# Altium schematic sheet Microcontroller.SchDoc
size A3; SheetNumber: 2; SheetTotal: 5
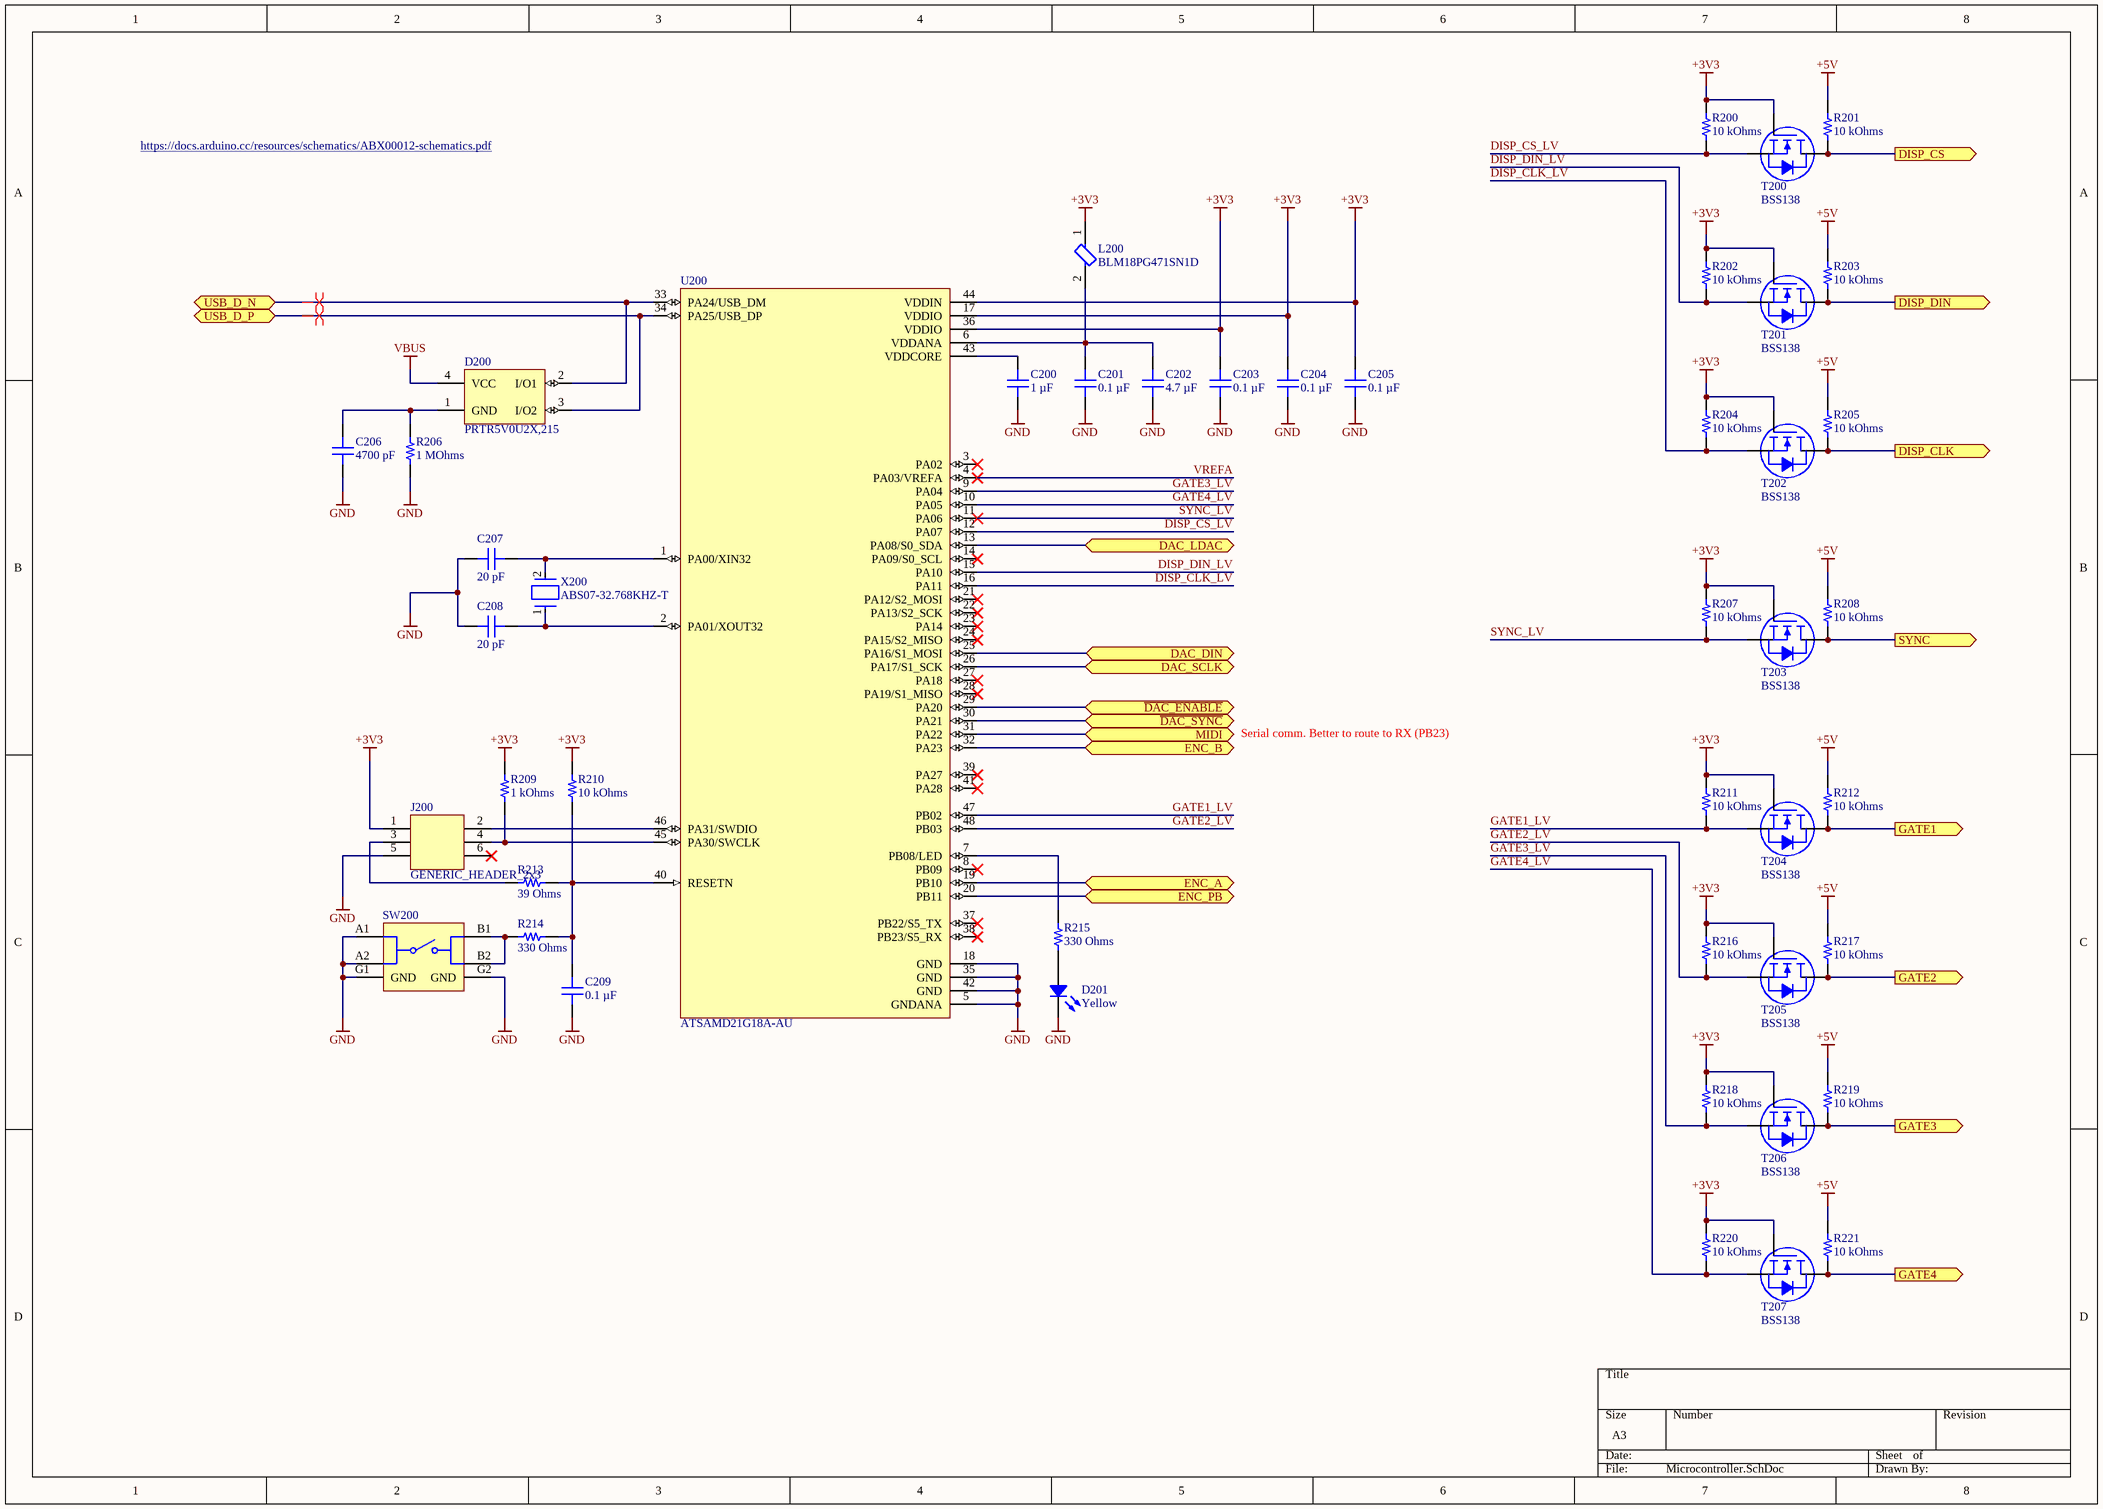
[diagram p0: Microcontroller.SchDoc]

## Parts
C200  1 µF  [CAP 0603_1608]
C201  0.1 µF  [CAP 0603_1608]
C202  4.7 µF  [CAP 0603_1608]
C203  0.1 µF  [CAP 0603_1608]
C204  0.1 µF  [CAP 0603_1608]
C205  0.1 µF  [CAP 0603_1608]
C206  4700 pF  [CAP 0603_1608]
C207  20 pF  [CAP 0603_1608]
C208  20 pF  [CAP 0603_1608]
C209  0.1 µF  [CAP 0603_1608]
D200  PRTR5V0U2X,215  [NXP-SOT143B-4_V]
D201  Yellow  [LED 0603_1608 YELLOW]
J200  GENERIC_HEADER_2x3  [HEADER_2x3_TH_MALE]
L200  BLM18PG471SN1D  [FP-BLM18-0_15-t0_8-MFG]
R200  10 kOhms  [RES 0603_1608]
R201  10 kOhms  [RES 0603_1608]
R202  10 kOhms  [RES 0603_1608]
R203  10 kOhms  [RES 0603_1608]
R204  10 kOhms  [RES 0603_1608]
R205  10 kOhms  [RES 0603_1608]
R206  1 MOhms  [RES 0603_1608]
R207  10 kOhms  [RES 0603_1608]
R208  10 kOhms  [RES 0603_1608]
R209  1 kOhms  [RES 0603_1608]
R210  10 kOhms  [RES 0603_1608]
R211  10 kOhms  [RES 0603_1608]
R212  10 kOhms  [RES 0603_1608]
R213  39 Ohms  [RES 0603_1608]
R214  330 Ohms  [RES 0603_1608]
R215  330 Ohms  [RES 0603_1608]
R216  10 kOhms  [RES 0603_1608]
R217  10 kOhms  [RES 0603_1608]
R218  10 kOhms  [RES 0603_1608]
R219  10 kOhms  [RES 0603_1608]
R220  10 kOhms  [RES 0603_1608]
R221  10 kOhms  [RES 0603_1608]
SW200  435171014816  [435171014816]  (value not drawn)
T200  BSS138  [ON SEMI SOT-23-3]
T201  BSS138  [ON SEMI SOT-23-3]
T202  BSS138  [ON SEMI SOT-23-3]
T203  BSS138  [ON SEMI SOT-23-3]
T204  BSS138  [ON SEMI SOT-23-3]
T205  BSS138  [ON SEMI SOT-23-3]
T206  BSS138  [ON SEMI SOT-23-3]
T207  BSS138  [ON SEMI SOT-23-3]
U200  ATSAMD21G18A-AU  [ATML-TQFP48]
X200  ABS07-32.768KHZ-T  [FP-ABS07-MFG]

## Ports
DAC_DIN (bidir), DAC_LDAC (bidir), DAC_SCLK (bidir), DISP_CLK (out), DISP_CS (out), DISP_DIN (out), ENC_A (bidir), ENC_B (bidir), ENC_PB (bidir), GATE1 (out), GATE2 (out), GATE3 (out), GATE4 (out), MIDI (bidir), SYNC (out), USB_D_N (bidir), USB_D_P (bidir), ~{DAC_ENABLE} (bidir), ~{DAC_SYNC} (bidir)

## Nets
+3V3: C203.2 C204.2 C205.2 J200.1 L200.1 R200.2 R202.2 R204.2 R207.2 R209.2 R210.2 R211.2 R216.2 R218.2 R220.2 T200.1(G) T201.1(G) T202.1(G) T203.1(G) T204.1(G) T205.1(G) T206.1(G) T207.1(G) U200.17(VDDIO) U200.36(VDDIO) U200.44(VDDIN)
+5V: R201.2 R203.2 R205.2 R208.2 R212.2 R217.2 R219.2 R221.2
GND: C200.1 C201.1 C202.1 C203.1 C204.1 C205.1 C206.1 C207.1 C208.1 C209.1 D201.2 J200.5 R206.1 SW200.A1 SW200.A2 SW200.G1(GND) SW200.G2(GND) U200.5(GNDANA) U200.18(GND) U200.35(GND) U200.42(GND)
VBUS: D200.4(VCC)
~{DAC_ENABLE}: U200.29(PA20) ; port ~{DAC_ENABLE}
~{DAC_SYNC}: U200.30(PA21) ; port ~{DAC_SYNC}
DAC_DIN: U200.25(PA16/S1_MOSI) ; port DAC_DIN
DAC_LDAC: U200.13(PA08/S0_SDA) ; port DAC_LDAC
DAC_SCLK: U200.26(PA17/S1_SCK) ; port DAC_SCLK
DISP_CLK: R205.1 T202.3(D) ; port DISP_CLK
DISP_CLK_LV: R204.1 T202.2(S) U200.16(PA11)
DISP_CS: R201.1 T200.3(D) ; port DISP_CS
DISP_CS_LV: R200.1 T200.2(S) U200.12(PA07)
DISP_DIN: R203.1 T201.3(D) ; port DISP_DIN
DISP_DIN_LV: R202.1 T201.2(S) U200.15(PA10)
ENC_A: U200.19(PB10) ; port ENC_A
ENC_B: U200.32(PA23) ; port ENC_B
ENC_PB: U200.20(PB11) ; port ENC_PB
GATE1: R212.1 T204.3(D) ; port GATE1
GATE1_LV: R211.1 T204.2(S) U200.47(PB02)
GATE2: R217.1 T205.3(D) ; port GATE2
GATE2_LV: R216.1 T205.2(S) U200.48(PB03)
GATE3: R219.1 T206.3(D) ; port GATE3
GATE3_LV: R218.1 T206.2(S) U200.9(PA04)
GATE4: R221.1 T207.3(D) ; port GATE4
GATE4_LV: R220.1 T207.2(S) U200.10(PA05)
MIDI: U200.31(PA22) ; port MIDI
SYNC: R208.1 T203.3(D) ; port SYNC
SYNC_LV: R207.1 T203.2(S) U200.11(PA06)
USB_D_N: D200.2(I/O1) U200.33(PA24/USB_DM) ; port USB_D_N
USB_D_P: D200.3(I/O2) U200.34(PA25/USB_DP) ; port USB_D_P
VREFA: U200.4(PA03/VREFA)
NetC200_2: C200.2 U200.43(VDDCORE)
NetC201_2: C201.2 C202.2 L200.2 U200.6(VDDANA)
NetC206_2: C206.2 D200.1(GND) R206.2
NetC207_2: C207.2 U200.1(PA00/XIN32) X200.2
NetC208_2: C208.2 U200.2(PA01/XOUT32) X200.1
NetC209_2: C209.2 R210.1 R213.2 R214.2 U200.40(RESETN)
NetD201_1: D201.1 R215.2
NetJ200_2: J200.2 U200.46(PA31/SWDIO)
NetJ200_3: J200.3 R213.1
NetJ200_4: J200.4 R209.1 U200.45(PA30/SWCLK)
NetR214_1: R214.1 SW200.B1 SW200.B2
NetR215_1: R215.1 U200.7(PB08/LED)

Not connected (* = marked no-connect by the designer): J200 6*; U200 3(PA02)* 8(PB09)* 14(PA09/S0_SCL)* 21(PA12/S2_MOSI)* 22(PA13/S2_SCK)* 23(PA14)* 24(PA15/S2_MISO)* 27(PA18)* 28(PA19/S1_MISO)* 37(PB22/S5_TX)* 38(PB23/S5_RX)* 39(PA27)* 41(PA28)*

## Layout directives
differential pair: USB_D_N, USB_D_P

## Notes on the sheet
- https://docs.arduino.cc/resources/schematics/ABX00012-schematics.pdf
- Serial comm. Better to route to RX (PB23)

## Library data of the parts
C200 = CC0603KRX7R6BB105: CAP CER 1UF 10V X7R 0603; manufacturer: Yageo; Tolerance: ±10%; Part Number: CC0603KRX7R6BB105; Value: 1 µF; Applications: General Purpose; Capacitance: 1 µF; componentlink1description: Datasheet; componentlink1url: https://www.yageo.com/upload/media/product/productsearch/datasheet/mlcc/UPY-GPHC_X7R_6.3V-to-50V_18.pdf; componentlink2description: DigiKey Link; componentlink2url: https://www.digikey.com/en/products/detail/yageo/CC0603KRX7R6BB105/5195204; Device Package: 0603 (1608 Metric); lastupdated: 09/02/2024 20:10:30; Lifecycle Status: Active; Minimum Order: 1; Mounting Type: Surface Mount, MLCC; Operating Temperature: -55°C ~ 125°C; Package / Case: 0603 (1608 Metric); packaging: TapeAndReel; partid: 2290; Part Status: Active; price: 0.01; series: CC; Size / Dimension: 0.063" L x 0.031" W (1.60mm x 0.80mm); Supplier 1: DigiKey; Supplier Part Number 1: 311-1796-1-ND; Temperature Coefficient: X7R; Thickness (Max): 0.035" (0.90mm); Voltage - Rated: 10V
C201 C203-C205 C209 = CS0603KRX7R7BB104: CAP CER 0.1UF 16V X7R 0603; manufacturer: Yageo; Tolerance: ±10%; Part Number: CS0603KRX7R7BB104; Value: 0.1 µF; Applications: Boardflex Sensitive; Capacitance: 0.1 µF; componentlink1description: Datasheet; componentlink1url: http://www.yageo.com/NewPortal/yageodocoutput?fileName=/pdf/MLCC/UPY-ST_NPOX7R_16V-to-3KV_5.pdf; componentlink2description: DigiKey Link; componentlink2url: https://www.digikey.com/en/products/detail/yageo/CS0603KRX7R7BB104/6097897; Device Package: 0603 (1608 Metric); Features: Soft Termination; lastupdated: 09/02/2024 20:10:30; Lifecycle Status: Active; Minimum Order: 1; Mounting Type: Surface Mount, MLCC; Operating Temperature: -55°C ~ 125°C; Package / Case: 0603 (1608 Metric); packaging: TapeAndReel; partid: 2286; Part Status: Active; price: 0.01; series: CS; Size / Dimension: 0.063" L x 0.031" W (1.60mm x 0.80mm); Supplier 1: DigiKey; Supplier Part Number 1: 311-3560-1-ND; Temperature Coefficient: X7R; Thickness (Max): 0.037" (0.95mm); Voltage - Rated: 16V
C202 = CC0603MRX5R6BB475: CAP CER 4.7UF 10V X5R 0603; manufacturer: Yageo; Tolerance: ±20%; Part Number: CC0603MRX5R6BB475; Value: 4.7 µF; Applications: General Purpose; Capacitance: 4.7 µF; componentlink1description: Datasheet; componentlink1url: https://www.yageo.com/upload/media/product/productsearch/datasheet/mlcc/UPY-GPHC_X5R_4V-to-50V_25.pdf; componentlink2description: DigiKey Link; componentlink2url: https://www.digikey.com/en/products/detail/yageo/CC0603MRX5R6BB475/5195227; Device Package: 0603 (1608 Metric); lastupdated: 09/02/2024 20:10:21; Lifecycle Status: Active; Minimum Order: 1; Mounting Type: Surface Mount, MLCC; Operating Temperature: -55°C ~ 85°C; Package / Case: 0603 (1608 Metric); packaging: TapeAndReel; partid: 9357; Part Status: Active; price: 0.02; series: CC; Size / Dimension: 0.063" L x 0.031" W (1.60mm x 0.80mm); Supplier 1: DigiKey; Supplier Part Number 1: 311-1820-1-ND; Temperature Coefficient: X5R; Thickness (Max): 0.035" (0.90mm); Voltage - Rated: 10V
C206 = CC0603JRX7R9BB472: CAP CER 4700PF 50V X7R 0603; manufacturer: Yageo; Tolerance: ±5%; Part Number: CC0603JRX7R9BB472; Value: 4700 pF; Applications: General Purpose; Capacitance: 4700 pF; componentlink1description: Datasheet; componentlink1url: https://www.yageo.com/upload/media/product/productsearch/datasheet/mlcc/UPY-GPHC_X7R_6.3V-to-50V_18.pdf; componentlink2description: DigiKey Link; componentlink2url: https://www.digikey.com/en/products/detail/yageo/CC0603JRX7R9BB472/5883693; Device Package: 0603 (1608 Metric); lastupdated: 09/02/2024 20:10:27; Lifecycle Status: Active; Minimum Order: 1; Mounting Type: Surface Mount, MLCC; Operating Temperature: -55°C ~ 125°C; Package / Case: 0603 (1608 Metric); packaging: TapeAndReel; partid: 5065; Part Status: Active; price: 0.01; series: CC; Size / Dimension: 0.063" L x 0.031" W (1.60mm x 0.80mm); Supplier 1: DigiKey; Supplier Part Number 1: 311-3363-1-ND; Temperature Coefficient: X7R; Thickness (Max): 0.035" (0.90mm); Voltage - Rated: 50V
C207 C208 = CC0603JRNPO9BN200: CAP CER 20PF 50V C0G/NPO 0603; manufacturer: Yageo; Temperature Coefficient: C0G, NP0; Tolerance: ±5%; Part Number: CC0603JRNPO9BN200; Value: 20 pF; Applications: General Purpose; Capacitance: 20 pF; componentlink1description: Datasheet; componentlink1url: https://www.yageo.com/upload/media/product/productsearch/datasheet/mlcc/UPY-GP_NP0_16V-to-50V_17.pdf; componentlink2description: DigiKey Link; componentlink2url: https://www.digikey.com/en/products/detail/yageo/CC0603JRNPO9BN200/2833589; Device Package: 0603 (1608 Metric); lastupdated: 09/02/2024 20:10:09; Lifecycle Status: Active; Minimum Order: 1; Mounting Type: Surface Mount, MLCC; Operating Temperature: -55°C ~ 125°C; Package / Case: 0603 (1608 Metric); packaging: TapeAndReel; partid: 16728; Part Status: Active; price: 0.01; series: CC; Size / Dimension: 0.063" L x 0.031" W (1.60mm x 0.80mm); Supplier 1: DigiKey; Supplier Part Number 1: 311-1424-1-ND; Thickness (Max): 0.035" (0.90mm); Voltage - Rated: 50V
D200 = PRTR5V0U2X,215: Ultra Low Capacitance Double Rail-to-Rail ESD Protection Diode, 5.5 V, 1 pF, -40 to 85 degC, 4-Pin SOT143B, RoHS, Tape and Reel; Manufacturer: NXP Semiconductors; Capacitance Value: 16pF; Number of Elements: 1; Rad Hardened: No; Reverse Breakdown Voltage: 6V; Working Voltage (Max): 5.5V; Polarity: Uni-Directional; Configuration: Quad; Leakage Current: 0.1uA; Product Height (mm): 1mm; Suppressor Type: DiodeArrays; Product Length (mm): 3mm; Product Depth (mm): 1.4mm; ESD Protection Voltage: 8KV@ContactDisc; Package Type: SOT; Mounting: SurfaceMount; Packaging: TapeandReel; Datasheet Version: Rev. 02, 01/2008; Reverse Stand-off Voltage: 5.5V; Manufacturer URL: http://www.nxp.com/; Operating Temp Range: -40Cto85C; Operating Temperature Classification: Industrial; Working Voltage: 5.5V; Operating Temperature Min Deg. C: -40C; Datasheet URL: https://datasheet.ciiva.com/4479/prtr5v0u2x-102853-4479461.pdf; Leakage Current (Max): 0.1uA; Direction Type: Uni-Directional; Pin Count: 3+Tab; Operating Temperature Max Deg. C: 85C; Mounting Style: SurfaceMount; Package / Case: SOT
D201 = 5990040007F: LED YELLOW 0603 SMD; Manufacturer: Dialight; Configuration: Standard; Current - Test: 20mA; Lens Color: 0.80mm; Lens Size: 1.10mm x 0.80mm; Lens Style: Rectangle with Flat Top; Millicandela Rating: 105mcd; Viewing Angle: 140°; Voltage - Forward (Vf) (Typ): 2.1V; Wavelength - Dominant: 590nm; Part Number: 5990040007F; Color: Yellow; ComponentLink1Description: Datasheet; ComponentLink1URL: http://www.dialightsignalsandcomponents.com/Assets/Brochures_And_Catalogs/Indication/CBI_SMD_new/Dialight_CBI_data_599-0603_Apr2018.pdf; ComponentLink2Description: DigiKey Link; ComponentLink2URL: https://www.digikey.com/en/products/detail/dialight/5990040007F/9385404; Device Package: 0603 (1608 Metric); Height (Max): 0.80mm; LastUpdated: 03/06/2024 20:01:10; Lifecycle Status: Active; Minimum Order: 1; Mounting Type: Surface Mount; Package / Case: 0603 (1608 Metric); Packaging: TapeAndReel; PartId: 83; Part Status: Active; Price: 0.04; Series: 599; Size / Dimension: 1.60mm L x 0.80mm W; Supplier 1: DigiKey; Supplier Part Number 1: 350-4349-1-ND; Supplier Device Package: 0603; Value: Yellow
J200 = GENERIC_HEADER_2x3: NexarPartId: 32855449; Number of Positions: 6; Voltage Rating: 250V; Current Rating: 3A; Pitch: 2.54mm; Gender: Male; Contact Resistance: 20mΩ; Connector Type: Male Pin; Packaging: Tape and Reel; Contact Plating: Gold; RoHS: Compliant; Termination: Solder; Operating Supply Voltage: 250V; REACH SVHC: Unknown; Mount: Surface Mount; Number of Pins: 6; Contact Mating Length: 5.9944mm; Contact Material: Copper; Max Operating Temperature: 105°C; Orientation: Vertical; Number of Contacts: 6; Min Operating Temperature: -40°C; Number of Rows: 2; Lead Pitch: 2.54mm; Height: 10mm; Row Spacing: 2.54mm; Color: Black
L200 = CMP-0686-00587-3: Chip Ferrite Bead, 0603, 470Ω @ 100MHz, 0.2Ω, 25%, 1A; DC Resistance (DCR): 200mR; Number of Circuits: 1; Material: Steel; Impedance: 470R; Core Material: Ferrite; Width: 0.8mm; Termination: SMD/SMT; Series: BLM18P; Min Operating Temperature: -55°C; DC Resistance-Max: 200mR; Current Rating: 1A; Package Quantity: 1; Max Operating Temperature: 125°C; Military Standard: Not; REACH SVHC: No SVHC; Max Current Rating: 1A; Number of Pins: 2; RoHS Compliant: Yes; Tolerance: 25%; Packaging: Tape and Reel; Number of Lines: 1; Resistance: 200mR; Length: 1.6mm; Case Code (Metric): 1608; Depth: 0.8mm; Lead Free: Lead Free; Case/Package: 0603; Height: 0.8mm; Radiation Hardening: No; Test Frequency: 100MHz; Case Code (Imperial): 0603; Max DC Current: 1A; DC Current: 1A
R200-R205 R207 R208 R210-R212 R216-R221 = CRCW060310K0FKTA: RES SMD 10K OHM 1% 1/10W 0603; Manufacturer: Vishay Dale; Power (Watts): 0.1W, 1/10W; Temperature Coefficient: ±100ppm/°C; Part Number: CRCW060310K0FKTA; Value: 10 kOhms; ComponentLink1Description: Datasheet; ComponentLink1URL: http://www.vishay.com/docs/20008/dcrcw.pdf; ComponentLink2Description: DigiKey Link; ComponentLink2URL: https://www.digikey.com/en/products/detail/vishay-dale/CRCW060310K0FKTA/1221625; Composition: Thick Film; Device Package: 0603 (1608 Metric); Features: Automotive AEC-Q200; Height - Seated (Max): 0.020" (0.50mm); LastUpdated: 12/07/2023 19:33:59; Lifecycle Status: Active; Minimum Order: 1; Number of Terminations: 2; Operating Temperature: -55°C ~ 155°C; Package / Case: 0603 (1608 Metric); Packaging: TapeAndReel; PartId: 9687; Part Status: Active; Price: 0.01; Ratings: AEC-Q200; Resistance: 10 kOhms; Series: CRCW; Size / Dimension: 0.063" L x 0.033" W (1.60mm x 0.85mm); Supplier 1: DigiKey; Supplier Part Number 1: 541-2980-1-ND; Supplier Device Package: 0603; Tolerance: ±1%
R206 = CRCW06031M00FKEA: RES SMD 1M OHM 1% 1/10W 0603; Manufacturer: Vishay Dale; Power (Watts): 0.1W, 1/10W; Temperature Coefficient: ±100ppm/°C; Part Number: CRCW06031M00FKEA; Value: 1 MOhms; ComponentLink1Description: Datasheet; ComponentLink1URL: http://www.vishay.com/docs/20035/dcrcwe3.pdf; ComponentLink2Description: DigiKey Link; ComponentLink2URL: https://www.digikey.com/en/products/detail/vishay-dale/CRCW06031M00FKEA/1175010; Composition: Thick Film; Device Package: 0603 (1608 Metric); Features: Automotive AEC-Q200; Height - Seated (Max): 0.020" (0.50mm); LastUpdated: 09/02/2024 20:43:06; Lifecycle Status: Active; Minimum Order: 1; Number of Terminations: 2; Operating Temperature: -55°C ~ 155°C; Package / Case: 0603 (1608 Metric); Packaging: TapeAndReel; PartId: 12567; Part Status: Active; Price: 0.01; Ratings: AEC-Q200; Resistance: 1 MOhms; Series: CRCW; Size / Dimension: 0.061" L x 0.033" W (1.55mm x 0.85mm); Supplier 1: DigiKey; Supplier Part Number 1: 541-1.00MHCT-ND; Supplier Device Package: 0603; Tolerance: ±1%
R209 = CRCW06031K00FKEB: RES SMD 1K OHM 1% 1/10W 0603; Manufacturer: Vishay Dale; Power (Watts): 0.1W, 1/10W; Temperature Coefficient: ±100ppm/°C; Part Number: CRCW06031K00FKEB; Value: 1 kOhms; ComponentLink1Description: Datasheet; ComponentLink1URL: http://www.vishay.com/docs/20035/dcrcwe3.pdf; ComponentLink2Description: DigiKey Link; ComponentLink2URL: https://www.digikey.com/en/products/detail/vishay-dale/CRCW06031K00FKEB/5071169; Composition: Thick Film; Device Package: 0603 (1608 Metric); Features: Automotive AEC-Q200; Height - Seated (Max): 0.020" (0.50mm); LastUpdated: 09/02/2024 20:43:36; Lifecycle Status: Active; Minimum Order: 1; Number of Terminations: 2; Operating Temperature: -55°C ~ 155°C; Package / Case: 0603 (1608 Metric); Packaging: CutTape; PartId: 5123; Part Status: Active; Price: 0.01; Ratings: AEC-Q200; Resistance: 1 kOhms; Series: CRCW; Size / Dimension: 0.063" L x 0.033" W (1.60mm x 0.85mm); Supplier 1: DigiKey; Supplier Part Number 1: 541-2985-1-ND; Supplier Device Package: 0603; Tolerance: ±1%
R213 = CRCW060339R0FKEA: RES SMD 39 OHM 1% 1/10W 0603; Manufacturer: Vishay Dale; Power (Watts): 0.1W, 1/10W; Temperature Coefficient: ±100ppm/°C; Part Number: CRCW060339R0FKEA; Value: 39 Ohms; ComponentLink1Description: Datasheet; ComponentLink1URL: http://www.vishay.com/docs/20035/dcrcwe3.pdf; ComponentLink2Description: DigiKey Link; ComponentLink2URL: https://www.digikey.com/en/products/detail/vishay-dale/CRCW060339R0FKEA/1174506; Composition: Thick Film; Device Package: 0603 (1608 Metric); Features: Automotive AEC-Q200; Height - Seated (Max): 0.020" (0.50mm); LastUpdated: 09/02/2024 20:43:24; Lifecycle Status: Active; Minimum Order: 1; Number of Terminations: 2; Operating Temperature: -55°C ~ 155°C; Package / Case: 0603 (1608 Metric); Packaging: TapeAndReel; PartId: 7916; Part Status: Active; Price: 0.01; Ratings: AEC-Q200; Resistance: 39 Ohms; Series: CRCW; Size / Dimension: 0.061" L x 0.033" W (1.55mm x 0.85mm); Supplier 1: DigiKey; Supplier Part Number 1: 541-39.0HCT-ND; Supplier Device Package: 0603; Tolerance: ±1%
R214 R215 = CRCW0603330RFKEAC: RES 330 OHM 1% 1/10W 0603; Manufacturer: Vishay Dale; Power (Watts): 0.1W, 1/10W; Temperature Coefficient: ±100ppm/°C; Part Number: CRCW0603330RFKEAC; Value: 330 Ohms; ComponentLink1Description: Datasheet; ComponentLink1URL: http://www.vishay.com/docs/28773/crcwce3.pdf; ComponentLink2Description: DigiKey Link; ComponentLink2URL: https://www.digikey.com/en/products/detail/vishay-dale/CRCW0603330RFKEAC/7928448; Composition: Thick Film; Device Package: 0603 (1608 Metric); Height - Seated (Max): 0.022" (0.55mm); LastUpdated: 09/02/2024 20:43:06; Lifecycle Status: Active; Minimum Order: 1; Number of Terminations: 2; Operating Temperature: -55°C ~ 155°C; Package / Case: 0603 (1608 Metric); Packaging: TapeAndReel; PartId: 12584; Part Status: Active; Price: 0.01; Resistance: 330 Ohms; Series: CRCW-C; Supplier 1: DigiKey; Supplier Part Number 1: 541-4026-1-ND; Supplier Device Package: 0603; Tolerance: ±1%
SW200 = CMP-03913-107782334-2: Tactile Switch, Spst-no, 0.05A, 12V, SMD;; Insulation Resistance: 100MΩ; Current Rating: 50mA; Min Operating Temperature: -40°C; RoHS: Compliant; Voltage Rating: 12V; Contact Plating: Silver; Max Operating Temperature: 85°C; Height: 1.4mm; Packaging: Tape and Reel
T200-T207 = BSS138: MOSFET N-CH 50V 220MA SOT-23; Manufacturer: ON Semiconductor; Current - Continuous Drain (Id) @ 25°C: 220mA (Ta); Drive Voltage (Max Rds On,  Min Rds On): 4.5V, 10V; FET Type: N-Channel; Gate Charge (Qg) (Max) @ Vgs: 2.4nC @ 10V; Input Capacitance (Ciss) (Max) @ Vds: 27pF @ 25V; Power Dissipation (Max): 360mW (Ta); Rds On (Max) @ Id, Vgs: 3.5Ohm @ 220mA, 10V; Vgs (Max): ±20V; Vgs(th) (Max) @ Id: 1.5V @ 1mA; Part Number: BSS138; ComponentLink1Description: Datasheet; ComponentLink1URL: https://www.onsemi.com/pub/Collateral/BSS138-D.PDF; ComponentLink2Description: DigiKey Link; ComponentLink2URL: http://digikey.com/product-detail/en/on-semiconductor/BSS138/BSS138CT-ND/244294; Drain to Source Voltage (Vdss): 50V; LastUpdated: 03/06/2024 20:15:26; Lifecycle Status: Active; Minimum Order: 1; Mounting Type: Surface Mount; Operating Temperature: -55°C ~ 150°C (TJ); Package / Case: TO-236-3, SC-59, SOT-23-3; Packaging: TapeAndReel; Part Status: Active; Price: 0.05; Series: -; Supplier 1: DigiKey; Supplier Part Number 1: BSS138CT-ND; Supplier Device Package: SOT-23-3; Technology: MOSFET (Metal Oxide)
U200 = ATSAMD21G18A-AU: SMART ARM-Based Microcontroller, 1.62 to 3.63 V, 256 KB Flash, 32 KB SRAM, -40 to 85 degC, 48-Pin TQFP, RoHS, Tray; Manufacturer: Atmel; Max Frequency: 48MHz; Number of Timers/Counters: 6; Max Supply Voltage: 3.63V; Min Supply Voltage: 1.62V; Packaging: Tray; Datasheet Version: Rev. N, 10/2016; Datasheet URL: http://www.atmel.com/images/atmel-42181-sam-d21_datasheet.pdf; REACH SVHC: NoSVHC; RoHSCompliant: true; Max Operating Temperature: 85degC; Manufacturer URL: http://www.atmel.com/; Contact Plating: Tin; Frequency: 48MHz; Package Description: 48-Pin Thin Profile Plastic Quad Flat Package, Body 7 x 7 mm, Pitch 0.5 mm; Package Reference: TQFP48; Lead Free: LeadFree; Number of Pins: 48; Min Operating Temperature: -40degC; Case/Package: TQFP; Mount: SurfaceMount
X200 = CMP-0447-00001-4: Crystal 32.768kHz ±20ppm (Tol) 12.5pF FUND 70kΩ 2-Pin CSMD T/R; ESR (Equivalent Series Resistance): 70kR; Radiation Hardening: No; Frequency: 32.768kHz; Length: 3.2mm; Max Operating Temperature: 85°C; Number of Pins: 2; Series: ABS07; Min Operating Temperature: -40°C; Frequency Tolerance: 20ppm; Packaging: Tape and Reel; Height: 0.9mm; Width: 1.5mm; Depth: 1.5mm; Load Capacitance: 12.5pF; RoHS Compliant: Yes; Tolerance: 20ppm; Termination: SMD/SMT; Lead Free: Lead Free; Series Resistance: 70kR; REACH SVHC: No SVHC; Case/Package: CSMD; Operating Frequency: 32.768 kHz; Package Quantity: 3000